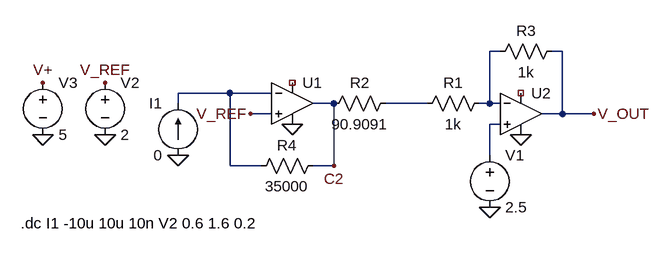
[diagram p0: schematic Back Current.asc]
Back Current.asc, the LTspice schematic file:
Version 4
SHEET 1 880 680
WIRE 352 48 336 48
WIRE 448 48 432 48
WIRE -64 112 -144 112
WIRE 0 112 -64 112
WIRE -144 128 -144 112
WIRE 96 128 64 128
WIRE 240 128 176 128
WIRE 336 128 336 48
WIRE 336 128 320 128
WIRE 352 128 336 128
WIRE 0 144 -32 144
WIRE 448 144 448 48
WIRE 448 144 416 144
WIRE 496 144 448 144
WIRE 352 160 336 160
WIRE 336 208 336 160
WIRE -64 224 -64 112
WIRE -16 224 -64 224
WIRE 96 224 96 128
WIRE 96 224 64 224
FLAG 32 160 0
FLAG 384 176 0
FLAG 336 288 0
FLAG 96 224 C2
FLAG -32 144 V_REF
FLAG -256 176 0
FLAG -352 176 0
FLAG -352 96 V+
FLAG -256 96 V_REF
FLAG -144 208 0
FLAG 496 144 V_OUT
SYMBOL OpAmps\\UniversalOpAmp 32 128 R0
SYMATTR InstName U1
SYMBOL OpAmps\\UniversalOpAmp 384 144 R0
SYMATTR InstName U2
SYMBOL res 336 112 R90
WINDOW 0 0 56 VBottom 2
WINDOW 3 32 56 VTop 2
SYMATTR InstName R1
SYMATTR Value 1k
SYMBOL res 192 112 R90
WINDOW 0 0 56 VBottom 2
WINDOW 3 32 56 VTop 2
SYMATTR InstName R2
SYMATTR Value 90.9091
SYMBOL res 448 32 R90
WINDOW 0 0 56 VBottom 2
WINDOW 3 32 56 VTop 2
SYMATTR InstName R3
SYMATTR Value 1k
SYMBOL voltage 336 192 R0
WINDOW 123 0 0 Left 0
WINDOW 39 0 0 Left 0
SYMATTR InstName V1
SYMATTR Value 2.5
SYMBOL res 80 208 R90
WINDOW 0 0 56 VBottom 2
WINDOW 3 32 56 VTop 2
SYMATTR InstName R4
SYMATTR Value 35000
SYMBOL voltage -256 80 R0
WINDOW 123 0 0 Left 0
WINDOW 39 0 0 Left 0
SYMATTR InstName V2
SYMATTR Value 2
SYMBOL voltage -352 80 R0
WINDOW 123 0 0 Left 0
WINDOW 39 0 0 Left 0
SYMATTR InstName V3
SYMATTR Value 5
SYMBOL current -144 208 R180
WINDOW 0 24 80 Left 2
WINDOW 3 24 0 Left 2
WINDOW 123 0 0 Left 0
WINDOW 39 0 0 Left 0
SYMATTR InstName I1
SYMATTR Value 0
TEXT -386 312 Left 2 !.dc I1 -10u 10u 10n V2 0.6 1.6 0.2

The netlist it stands for:
* Back Current.asc
XU1 V_REF N002 NC_01 0 C2 level1 Avol=1Meg GBW=10Meg Vos=0 En=0 Enk=0 In=0 Ink=0 Rin=500Meg  ; pins In+ In- V+ V- OUT
XU2 N004 N001 NC_02 0 V_OUT level1 Avol=1Meg GBW=10Meg Vos=0 En=0 Enk=0 In=0 Ink=0 Rin=500Meg  ; pins In+ In- V+ V- OUT
R1 N001 N003 1k
R2 N003 C2 90.9091
R3 V_OUT N001 1k
V1 N004 0 2.5
R4 C2 N002 35000
V2 V_REF 0 2
V3 V+ 0 5
I1 0 N002 0
.dc I1 -10u 10u 10n V2 0.6 1.6 0.2
.lib UniversalOpAmp1.lib
.backanno
.end